# EAGLE schematic WiFi board (EAGLE 6.3)
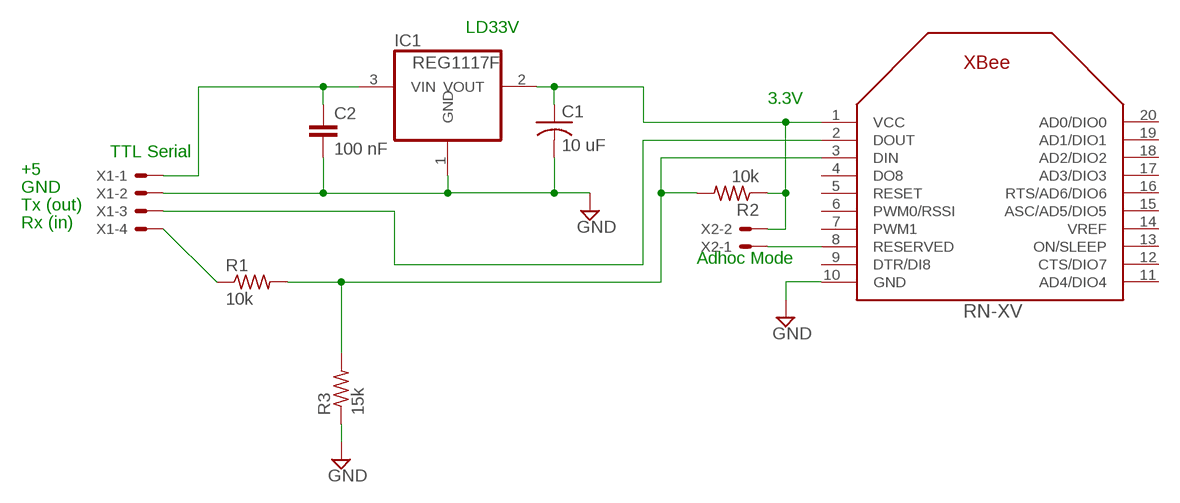
[diagram p0: schematic, sheet 1]

## Parts
C1  10 uF  C-US025-024X044  [C025-024X044]
C2  100 nF  C2,5-3  [C2.5-3]
IC1  REG1117F  [DD-3]
R1  10k  R-US_0204/7  [0204/7]
R2  10k  R-US_0204/7  [0204/7]
R3  15k  R-US_0204/7  [0204/7]
RN-XV  XBEE  [XBEE]
X1  TTL serial  22-23-2041  [22-23-2041]
X2  22-23-2021  [22-23-2021]

## Nets
GND: C1.2 C2.2 IC1.1(GND) R3.1 RN-XV.10(GND) X1.2
N$1: C2.1 IC1.3(VIN) X1.1
N$2: R1.2 R2.2 R3.2 RN-XV.3(DIN)
N$3: RN-XV.8(RESERVED) X2.1
N$4: RN-XV.2(DOUT) X1.3
N$5: R1.1 X1.4
VCC: C1.1 IC1.2(VOUT) R2.1 RN-XV.1(VCC) X2.2
Unconnected: RN-XV.4(DO8) RN-XV.5(RESET) RN-XV.6(PWM0/RSSI) RN-XV.7(PWM1) RN-XV.9(DTR/DI8) RN-XV.11(AD4/DIO4) RN-XV.12(CTS/DIO7) RN-XV.13(ON/SLEEP) RN-XV.14(VREF) RN-XV.15(ASC/AD5/DIO5) RN-XV.16(RTS/AD6/DIO6) RN-XV.17(AD3/DIO3) RN-XV.18(AD2/DIO2) RN-XV.19(AD1/DIO1) RN-XV.20(AD0/DIO0)

## Notes on the sheet
- LD33V
- 3.3V
- TTL Serial
- +5
- GND
- Tx (out)
- Rx (in)
- Adhoc Mode

## Library data of the parts
C1 = adafruit:C-US: CAPACITOR, American symbol
C2 = capacitor-wima:C: CAPACITOR naming: grid - package width
IC1 = burr-brown:REG1117: 800mA and 1A Low Dropout (LDO) Positive Regulator 1.8V, 2.5V, 2.85V, 3.3V, 5V, and Adj; MF: TEXAS INSTRUMENTS; MPN: REG1117FAKTTT; OC_FARNELL: 1296120; OC_NEWARK: 87H2562
R1-R3 = adafruit:R-US_: RESISTOR, American symbol
RN-XV = adafruit:XBEE
X1 = con-molex:22-23-2041: .100" (2.54mm) Center Header - 4 Pin; MF: MOLEX; MPN: 22-23-2041; OC_FARNELL: 1462920; OC_NEWARK: 38C0355
X2 = con-molex:22-23-2021: .100" (2.54mm) Center Header - 2 Pin; MF: MOLEX; MPN: 22-23-2021; OC_FARNELL: 1462926; OC_NEWARK: 25C3832